# Altium schematic sheet ĐỀ20.SchDoc
size A3; SheetNumber: 1; SheetTotal: 1; SPICEModelCacheEVRCJAMC: <root> / <DocumentId>EVRCJAMC</DocumentId> / <CacheFrame Number="0"> / <Model Name="fuse" Kind="CKT"> / <Text>.SUBCKT FUSE 1 2 PARAMS: CURRENT=1 RESISTANCE=1m / SW1 1 2 3 0 SMOD OFF / BNLV 3 0 V=(abs(v(1,2))) / .MODEL SMOD SW (VT={(CURRENT*RESISTANCE)} RON=1g ROFF={RESISTANCE}) / .ENDS FUSE</Text> / </Model> / <Model Name="bridge" Kind="CKT"> / <Text>*Default Diode Bridge Rectifier / *Connections: / *              V- / *              | AC1 / *              | | V+ / *              | | | AC2 / *              | | | | / .SUBCKT BRIDGE 1 2 3 4 / D1 1 2 DMOD / D2 1 4 DMOD / D3 2 3 DMOD / D4 4 3 DMOD / .MODEL DMOD D () / .ENDS BRIDGE</Text> / </Model> / <Model Name="diode" Kind="MDL"> / <Text>*Default Diode / *Diode Pinout: A,K / .MODEL DIODE D()</Text> / </Model> / <Model Name="zener" Kind="MDL"> / <Text>*ZENER / *Default Zener 10V @ 10mA / *Zener Diode Pinout: A,K / .MODEL ZENER D( BV=10 IBV=10E-3 )</Text> / </Model> / <Model Name="ni3wtrans" Kind="CKT"> / <Text>*Non-ideal 4-winding Transformer / *jjt created 18/1/2001. / *jjt 18/1/2002: changed LX2D,LX3D comments to match subcircuit parameters (X2D, X3D) to avoid possible confusion. / *Connections: / *                 Pri+ / *                 |   Pri- / *                 |   |   Sec1+ / *                 |   |   |   Sec1- / *                 |   |   |   |   Sec2+ / *                 |   |   |   |   |   Sec2- / *                 |   |   |   |   |   | / *                 |   |   |   |   |   | / *                 |   |   |   |   |   | / *                 |   |   |   |   |   | / .SUBCKT NI3WTRANS 1   2   3   4   5   6      PARAMS: RATIO1=1 RATIO2=1 RPRI=0.1 R2D=0.1 R3D=0.1 L1=1U / + X2D=1u X3D=1u XM=1k RCORE=1Meg / VISRC1   4 11 0V / VISRC2   6 14 0V / FCTRL1   10 2 VISRC1 {RATIO1} / FCTRL2   13 2 VISRC2 {RATIO2} / EVCVS1   3 11 10 2 {RATIO1} / EVCVS2   5 14 13 2 {RATIO2} / RRPRI    1 8 {RPRI} / RR2D    9 10 {R2D} / RR3D    12 13 {R3D} / LL1   8 7 {L1} / LX2D  7 9 {X2D} / LX3D  7 12 {X3D} / LXM   7 2 {XM} / RRCORE 7 2 {RCORE} / .ENDS NI3WTRANS</Text> / </Model> / <Model Name="irf1010" Kind="CKT"> / <Text>*IRF1010 MCE 4-2-96 / *55V  75A .014 ohm HEXFET pkg:TO-220 2,1,3 / .SUBCKT IRF1010  10 20 40 40 / M1   1  2  3  3  DMOS L=1U W=1U / RD  10  1  5.65M / RS  30  3  1.35M / RG  20  2  12.1 / CGS  2  3  2.15N / EGD 12  0  2  1  1 / VFB 14  0  0 / FFB  2  1  VFB  1 / CGD 13 14  4.49N / R1  13  0  1 / D1  12 13  DLIM / DDG 15 14  DCGD / R2  12 15  1 / D2  15  0  DLIM / DSD  3 10  DSUB / LS  30 40  7.5N / .MODEL DMOS NMOS (LEVEL=3 THETA=60M VMAX=114K ETA=2M VTO=3 KP=19.4) / .MODEL DCGD D (CJO=4.49N VJ=.6 M=.68) / .MODEL DSUB D (IS=311N N=1.5 RS=8.67M BV=55 CJO=4.08N VJ=.8 M=.42 TT=100N) / .MODEL DLIM D (IS=100U) / .ENDS IRF1010</Text> / </Model> / <Model Name="2n3906" Kind="MDL"> / <Text>*2N3906 / *Si 310mW  40V 200mA 250MHz pkg:TO-92B 1,2,3 / .MODEL 2N3906 PNP(IS=4E-14 BF=400 VAF=50 IKF=0.02 ISE=7E-15 NE=1.16 / + BR=7.5 RC=2.4 CJE=6.3E-12 VJE=0.75 TF=5E-10 CJC=5.8E-12 VJC=0.75 TR=2.3E-8 / + VJS=0.75 XTB=1.5 KF=6E-16 )</Text> / </Model> / </CacheFrame> / </root>
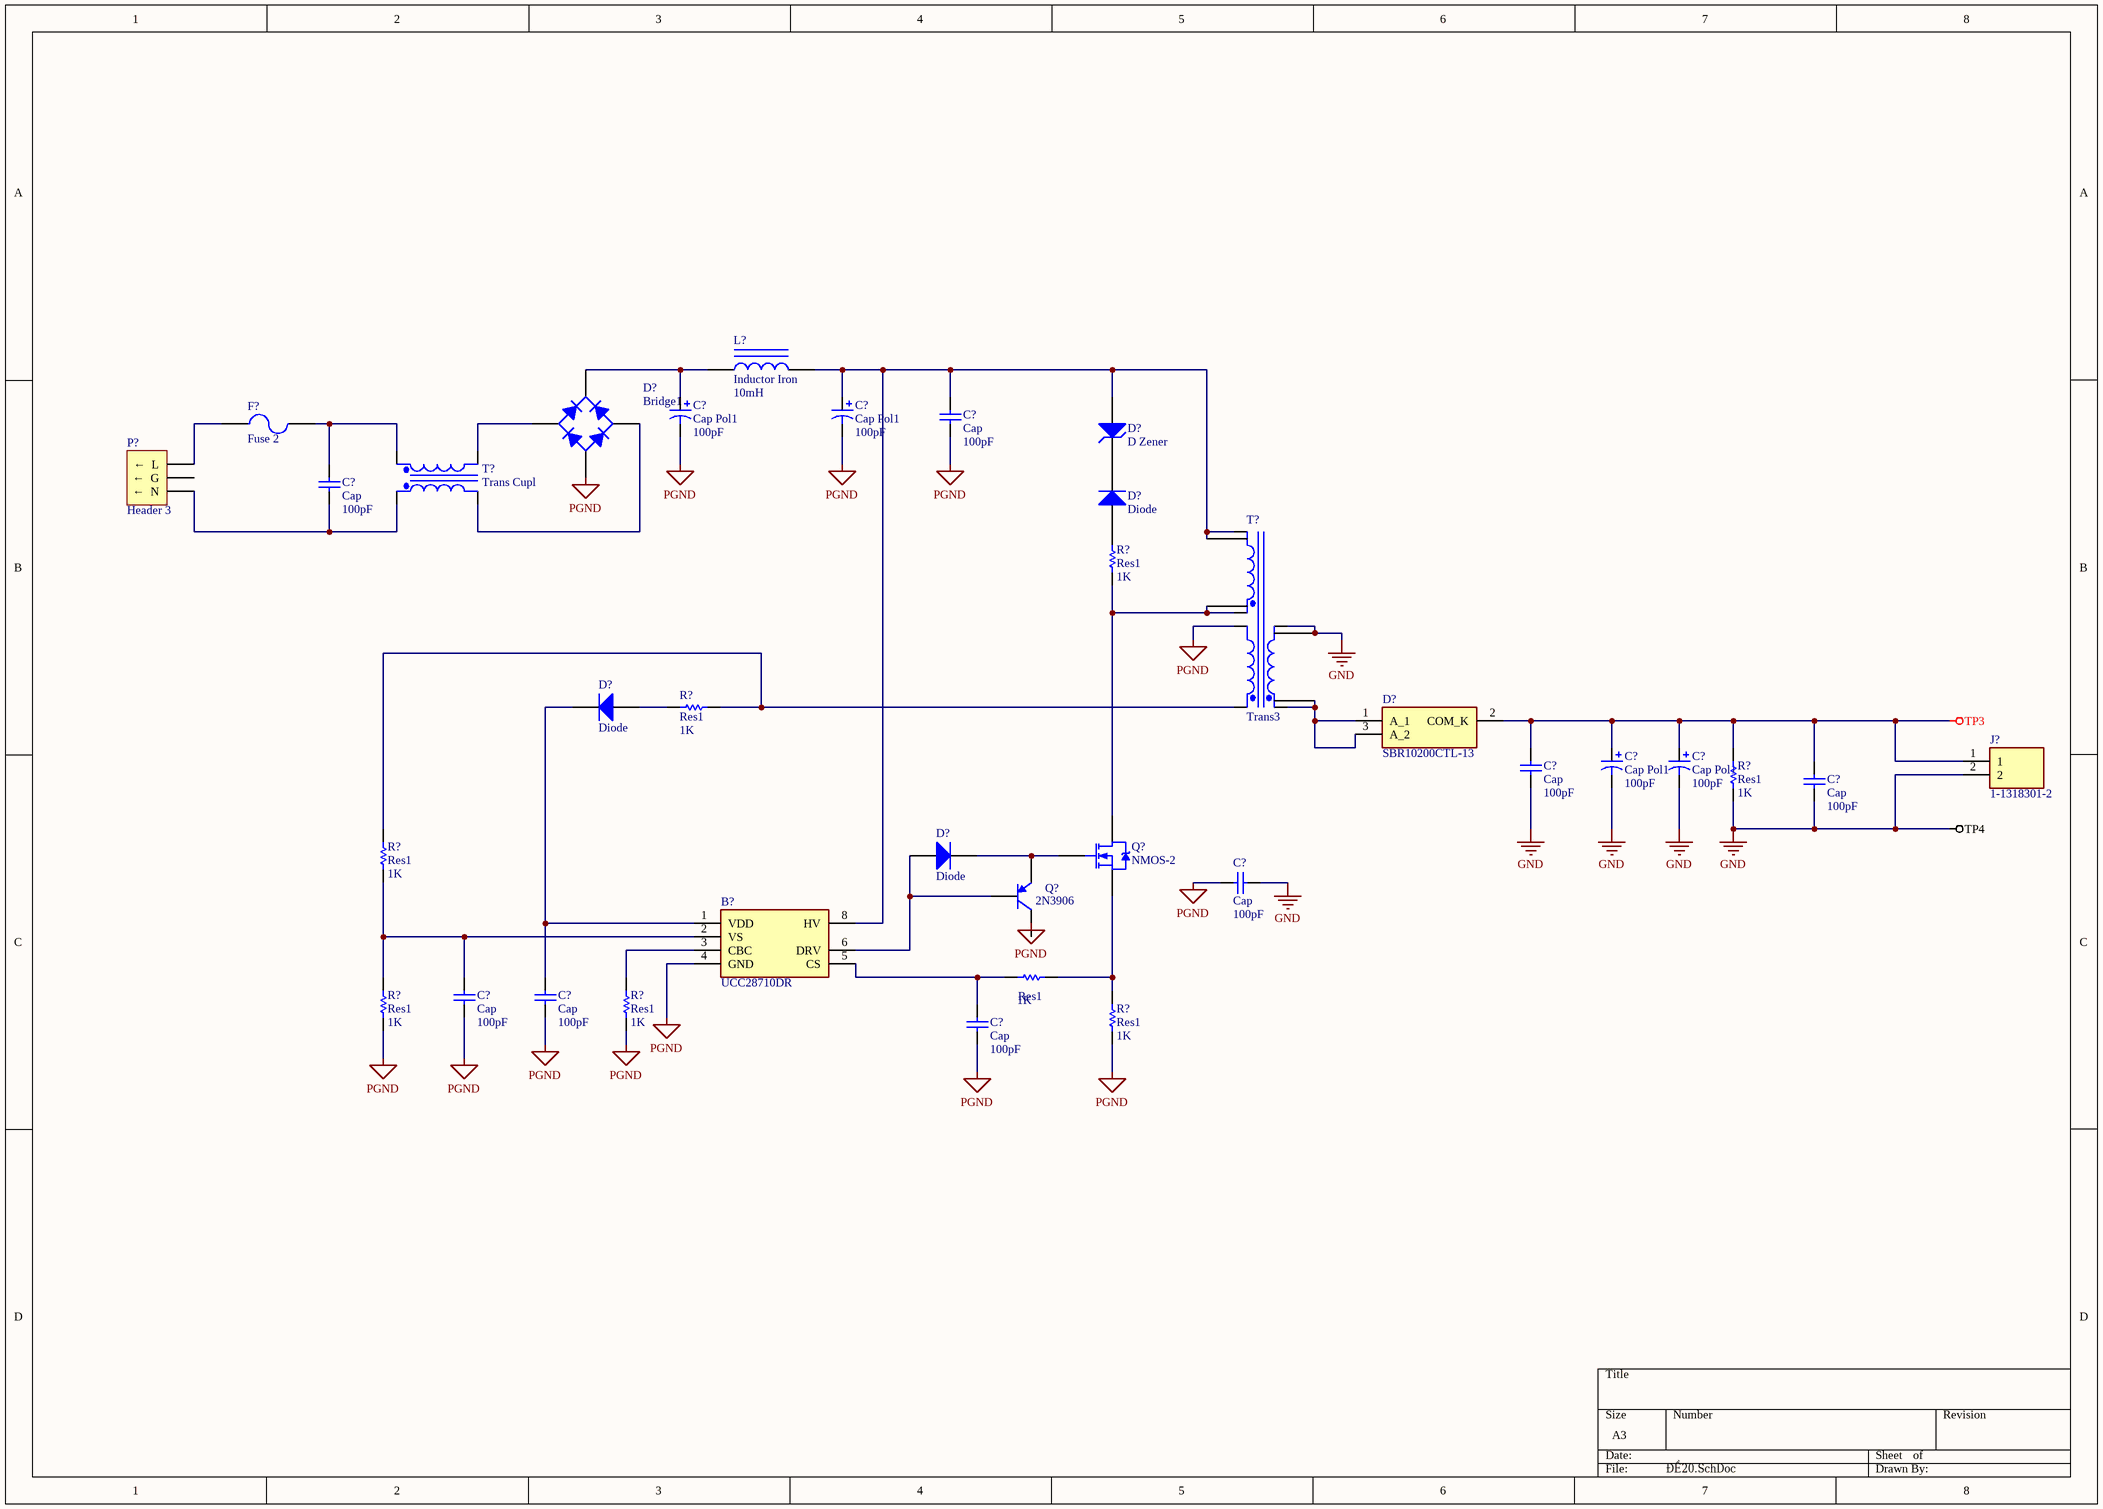
[diagram p0: ĐỀ20.SchDoc]

## Parts
(Parts that share a designator on the sheet are numbered #1, #2 ... from top to bottom, then left to right.)
B?  UCC28710DR  [SOIC127P600X175-8N]
C?#1  Cap Pol1  value 100pF  [RB7.6-15]
C?#2  Cap Pol1  value 100pF  [RB7.6-15]
C?#3  Cap  value 100pF  [RAD-0.3]
C?#4  Cap  value 100pF  [RAD-0.3]
C?#5  Cap Pol1  value 100pF  [RB7.6-15]
C?#6  Cap Pol1  value 100pF  [RB7.6-15]
C?#7  Cap  value 100pF  [RAD-0.3]
C?#8  Cap  value 100pF  [RAD-0.3]
C?#9  Cap  value 100pF  [RAD-0.3]
C?#10  Cap  value 100pF  [RAD-0.3]
C?#11  Cap  value 100pF  [RAD-0.3]
C?#12  Cap  value 100pF  [RAD-0.3]
D?#1  D Zener  [DIODE-0.7]
D?#2  Bridge1  [D-38]
D?#3  Diode  [SMC]
D?#4  Diode  [SMC]
D?#5  SBR10200CTL-13  [SBR10200CTL13]
D?#6  Diode  [SMC]
F?  Fuse 2  [PIN-W2/E2.8]
J?  1-1318301-2  [113183012]
L?  Inductor Iron  value 10mH  [AXIAL-0.9]
P?  Header 3  [HDR1X3]
Q?#1  NMOS-2  [TO-220AB]
Q?#2  2N3906  [TO-92A]
R?#1  Res1  value 1K  [AXIAL-0.3]
R?#2  Res1  value 1K  [AXIAL-0.3]
R?#3  Res1  value 1K  [AXIAL-0.3]
R?#4  Res1  value 1K  [AXIAL-0.3]
R?#5  Res1  value 1K  [AXIAL-0.3]
R?#6  Res1  value 1K  [AXIAL-0.3]
R?#7  Res1  value 1K  [AXIAL-0.3]
R?#8  Res1  value 1K  [AXIAL-0.3]
T?#1  Trans Cupl  [TRF_4]
T?#2  Trans3  [TRF_6]

## Nets
GND: C?#5.2 C?#6.2 C?#7.1 C?#8.1 C?#9.2 J?.2 R?#3.1 T?#2.2(Pri-) T?#2.8  [also labelled TP4]
PGND: B?.4(GND) C?#1.2 C?#2.2 C?#3.1 C?#9.1 C?#10.1 C?#11.1 C?#12.1 D?#2.3(A) R?#6.1 R?#7.1 R?#8.1 T?#2.4(Sec1-)
TP3: C?#5.1 C?#6.1 C?#7.2 C?#8.2 D?#5.2(COM_K) J?.1 R?#3.2
NetB?_1: B?.1(VDD) C?#11.2 D?#4.2(K)
NetB?_2: B?.2(VS) C?#10.2 R?#4.1 R?#6.2
NetB?_3: B?.3(CBC) R?#7.2
NetB?_5: B?.5(CS) C?#12.2 R?#5.1
NetB?_6: B?.6(DRV) D?#6.1(A) Q?#2.2(B)
NetB?_8: B?.8(HV) C?#2.1 C?#3.2 D?#1.1(A) L?.2 T?#2.0 T?#2.6(Sec2-)
NetC?#1_1: C?#1.1 D?#2.1(K) L?.1
NetC?#4_1: C?#4.1 P?.1(←__N) T?#1.1(Pri+)
NetC?#4_2: C?#4.2 F?.2 T?#1.3(Sec+)
NetD?#1_2: D?#1.2(K) D?#3.2(K)
NetD?#2_2: D?#2.2(C) T?#1.2(Pri-)
NetD?#2_4: D?#2.4(C) T?#1.4(Sec-)
NetD?#3_1: D?#3.1(A) R?#1.2
NetD?#4_1: D?#4.1(A) R?#2.1
NetD?#5_1: D?#5.1(A_1) D?#5.3(A_2) T?#2.1(Pri+) T?#2.9
NetD?#6_2: D?#6.2(K) Q?#1.1(G) Q?#2.1(E)
NetF?_1: F?.1 P?.3(←__L)
NetQ?#1_2: Q?#1.2(D) R?#1.1 T?#2.5(Sec2+) T?#2.7
NetQ?#1_3: Q?#1.3(S) R?#5.2 R?#8.2
NetR?#2_2: R?#2.2 R?#4.2 T?#2.3(Sec1+)

Not connected (* = marked no-connect by the designer): P? 2(←__G); Q?#2 3(C)

## Notes on the sheet
- Labels drawn without touching a wire or pin: PGND

## Library data of the parts
B? = UCC28710DR: Constant-Voltage, Constant-Current PWM Controller with Primary-Side Regulation; Manufacturer_Name: Texas Instruments; Geometry.Height: 1.75mm; Manufacturer_Part_Number: UCC28710DR; Mouser Part Number: 595-UCC28710DR; Mouser Price/Stock: https://www.mouser.co.uk/ProductDetail/Texas-Instruments/UCC28710DR?qs=T1E5mKGHTGXBTXx0kdQpWQ%3D%3D; Arrow Part Number: UCC28710DR; Arrow Price/Stock: https://www.arrow.com/en/products/ucc28710dr/texas-instruments?region=nac; Datasheet Link: http://www.ti.com/lit/ds/symlink/ucc28710.pdf
C?#1 C?#2 C?#5 C?#6 = Cap Pol1: Polarized Capacitor (Radial); Published: 8-Jun-2000; LatestRevisionDate: 17-Jul-2002; LatestRevisionNote: Re-released for DXP Platform.; PackageReference: RB7.6-15; Publisher: Altium Limited; PackageDescription: Polarized Capacitor (Radial); 2 Leads
C?#3 C?#4 C?#7-C?#12 = Cap: Capacitor; Published: 8-Jun-2000; LatestRevisionDate: 17-Jul-2002; LatestRevisionNote: Re-released for DXP Platform.; PackageReference: RAD-0.3; Publisher: Altium Limited; PackageDescription: Radial Cap, Thru-Hole; 2 Leads; 0.3 in Pin Spacing
D?#1 = D Zener: Zener Diode; Published: 8-Jun-2000; LatestRevisionDate: 17-Jul-2002; LatestRevisionNote: Re-released for DXP Platform.; PackageReference: DIODE-0.7; Publisher: Altium Limited; PackageDescription: Diode, Thru-Hole; 2 Leads; 0.7 in Pin Spacing
D?#2 = Bridge1: Full Wave Diode Bridge; Published: 8-Jun-2000; LatestRevisionDate: 29-May-2009; LatestRevisionNote: Sch pins A & K swapped.; DatasheetVersion: E2732B; PackageReference: D-38; Publisher: Altium Limited; PackageDescription: Bridge Rectifier; 4 Terminals; Body 9.4 x 9.4 mm (typ); Pitch 5.08 mm
D?#3 D?#4 D?#6 = Diode: Default Diode; Published: 8-Jun-2000; LatestRevisionDate: 17-Jul-2002; LatestRevisionNote: Re-released for DXP Platform.; PackageVersion: Sep-1996; PackageReference: SMC; Publisher: Altium Limited; PackageDescription: DO-214-AB/SMC; 2 C-Bend Leads; Body 7.9 x 5.9 mm, inc. leads (LxW); Code_JEDEC: DO-214-AB
D?#5 = SBR10200CTL-13: Schottky Diodes & Rectifiers Super Barrier Rectif TO252 T&R 2.5K; Manufacturer_Name: Diodes Incorporated; Geometry.Height: 2.52mm; Manufacturer_Part_Number: SBR10200CTL-13; Mouser Part Number: 621-SBR10200CTL-13; Mouser Price/Stock: https://www.mouser.co.uk/ProductDetail/Diodes-Incorporated/SBR10200CTL-13?qs=aXnpsjvrXd14kGc6%2FFum3Q%3D%3D; Arrow Part Number: SBR10200CTL-13; Arrow Price/Stock: https://www.arrow.com/en/products/sbr10200ctl-13/diodes-incorporated; Datasheet Link: https://www.diodes.com//assets/Datasheets/SBR10200CTL.pdf
F? = Fuse 2: Fuse; Published: 8-Jun-2000; LatestRevisionDate: 17-Jul-2002; LatestRevisionNote: Re-released for DXP Platform.; PackageReference: PIN-W2/E2.8; Publisher: Altium Limited; PackageDescription: Thru-Hole; 2 Leads
J? = 1-1318301-2: PCB Mount Header, Vertical, Wire-to-Board, 3 Position, 3.96 mm [.156 in] Centerline, Partially Shrouded, Tin, Through Hole - Solder, Economy Power; Manufacturer_Name: TE Connectivity; Geometry.Height: 10.7mm; Manufacturer_Part_Number: 1-1318301-2; Mouser Part Number: 571-1-1318301-2; Mouser Price/Stock: https://www.mouser.co.uk/ProductDetail/TE-Connectivity-AMP/1-1318301-2?qs=vnwGVgFuQibNN3nEnsSWWQ%3D%3D; Arrow Part Number: 1-1318301-2; Arrow Price/Stock: https://www.arrow.com/en/products/1-1318301-2/te-connectivity?region=nac; Datasheet Link: https://static6.arrow.com/aropdfconversion/1191fc6132a01f1dac1774e1fdbbbc6641a58965/23348988594208862334882874311460eng_ds_82056_mta_0608.pdf
L? = Inductor Iron: Magnetic-Core Inductor; Published: 24-Mar-1999; LatestRevisionDate: 17-Jul-2002; LatestRevisionNote: Re-released for DXP Platform.; PackageReference: AXIAL-0.9; Publisher: Altium Limited; PackageDescription: Axial Device, Thru-Hole; 2 Leads; 0.9 in Pin Spacing
P? = Header 3: Header, 3-Pin; LatestRevisionDate: 17-Jul-2002; LatestRevisionNote: Re-released for DXP Platform.; Publisher: Altium Limited
Q?#1 = NMOS-2: N-Channel Power MOSFET; Note: Pin 2 is electrically connected to pin 4.; Published: 8-Jun-2000; LatestRevisionDate: 17-Jul-2002; LatestRevisionNote: Re-released for DXP Platform.; DatasheetVersion: PD-9.814; PackageVersion: Feb-1997; PackageReference: TO-220AB; Publisher: Altium Limited; PackageDescription: TO, Thru-Hole, Vertical, Heatsink Mounted; 3 In-Line Leads; Pitch 2.54 mm; ComponentLink1Description: Manufacturer Link; ComponentLink1URL: http://www.irf.com/
Q?#2 = 2N3906: PNP General Purpose Amplifier; Published: 8-Jun-2000; LatestRevisionDate: 15-Jan-2003; LatestRevisionNote: PCB Footprint 'BCY-W3/D4.7' replaced; DatasheetVersion: 1997; PackageVersion: Sep-1998; PackageReference: TO-92A; Publisher: Altium Limited; PackageDescription: TO, Flat Index; 3 In-Line, Axial Leads; Body Dia. 4.5mm; Leads 0.51 x 0.48 mm (max); ComponentLink1Description: Manufacturer Link; ComponentLink1URL: http://www.fairchildsemi.com/; ComponentLink2Description: Datasheet; ComponentLink2URL: http://www.fairchildsemi.com/ds/2N%2F2N3906.pdf
R?#1-R?#8 = Res1: Resistor; Published: 8-Jun-2000; LatestRevisionDate: 17-Jul-2002; LatestRevisionNote: Re-released for DXP Platform.; PackageReference: AXIAL-0.3; Publisher: Altium Limited; PackageDescription: Axial Device, Thru-Hole; 2 Leads; 0.3 in Pin Spacing
T?#1 = Trans Cupl: Transformer (Coupled Inductor Model); Published: 8-Jun-2000; LatestRevisionDate: 17-Jul-2002; LatestRevisionNote: Re-released for DXP Platform.; PackageReference: TRF_4; Publisher: Altium Limited; PackageDescription: Transformer; 4 Leads
T?#2 = Trans3: Three-winding Transformer (Non-Ideal); Sim Note: Enter the turns ratios, Core loss resistance, Magnetising Reactance, Leakage Reactances and Resistances referred to the primary side into the parameter fields.; Published: 25-Jan-2001; LatestRevisionDate: 17-Jul-2002; LatestRevisionNote: Re-released for DXP Platform.; PackageReference: TRF_6; Publisher: Altium Limited; PackageDescription: Transformer; 6 Leads